# EasyEDA schematic EasyEDA Schematic_Split Flap Remote Board with Index 12-1-23.json
TITLE: Split Flap Remote Board with Index; REV: 1.0; Date: 2023-04-25; Sheet: 1/1; Drawn By: jpwolfe31; Company: John Wolfe
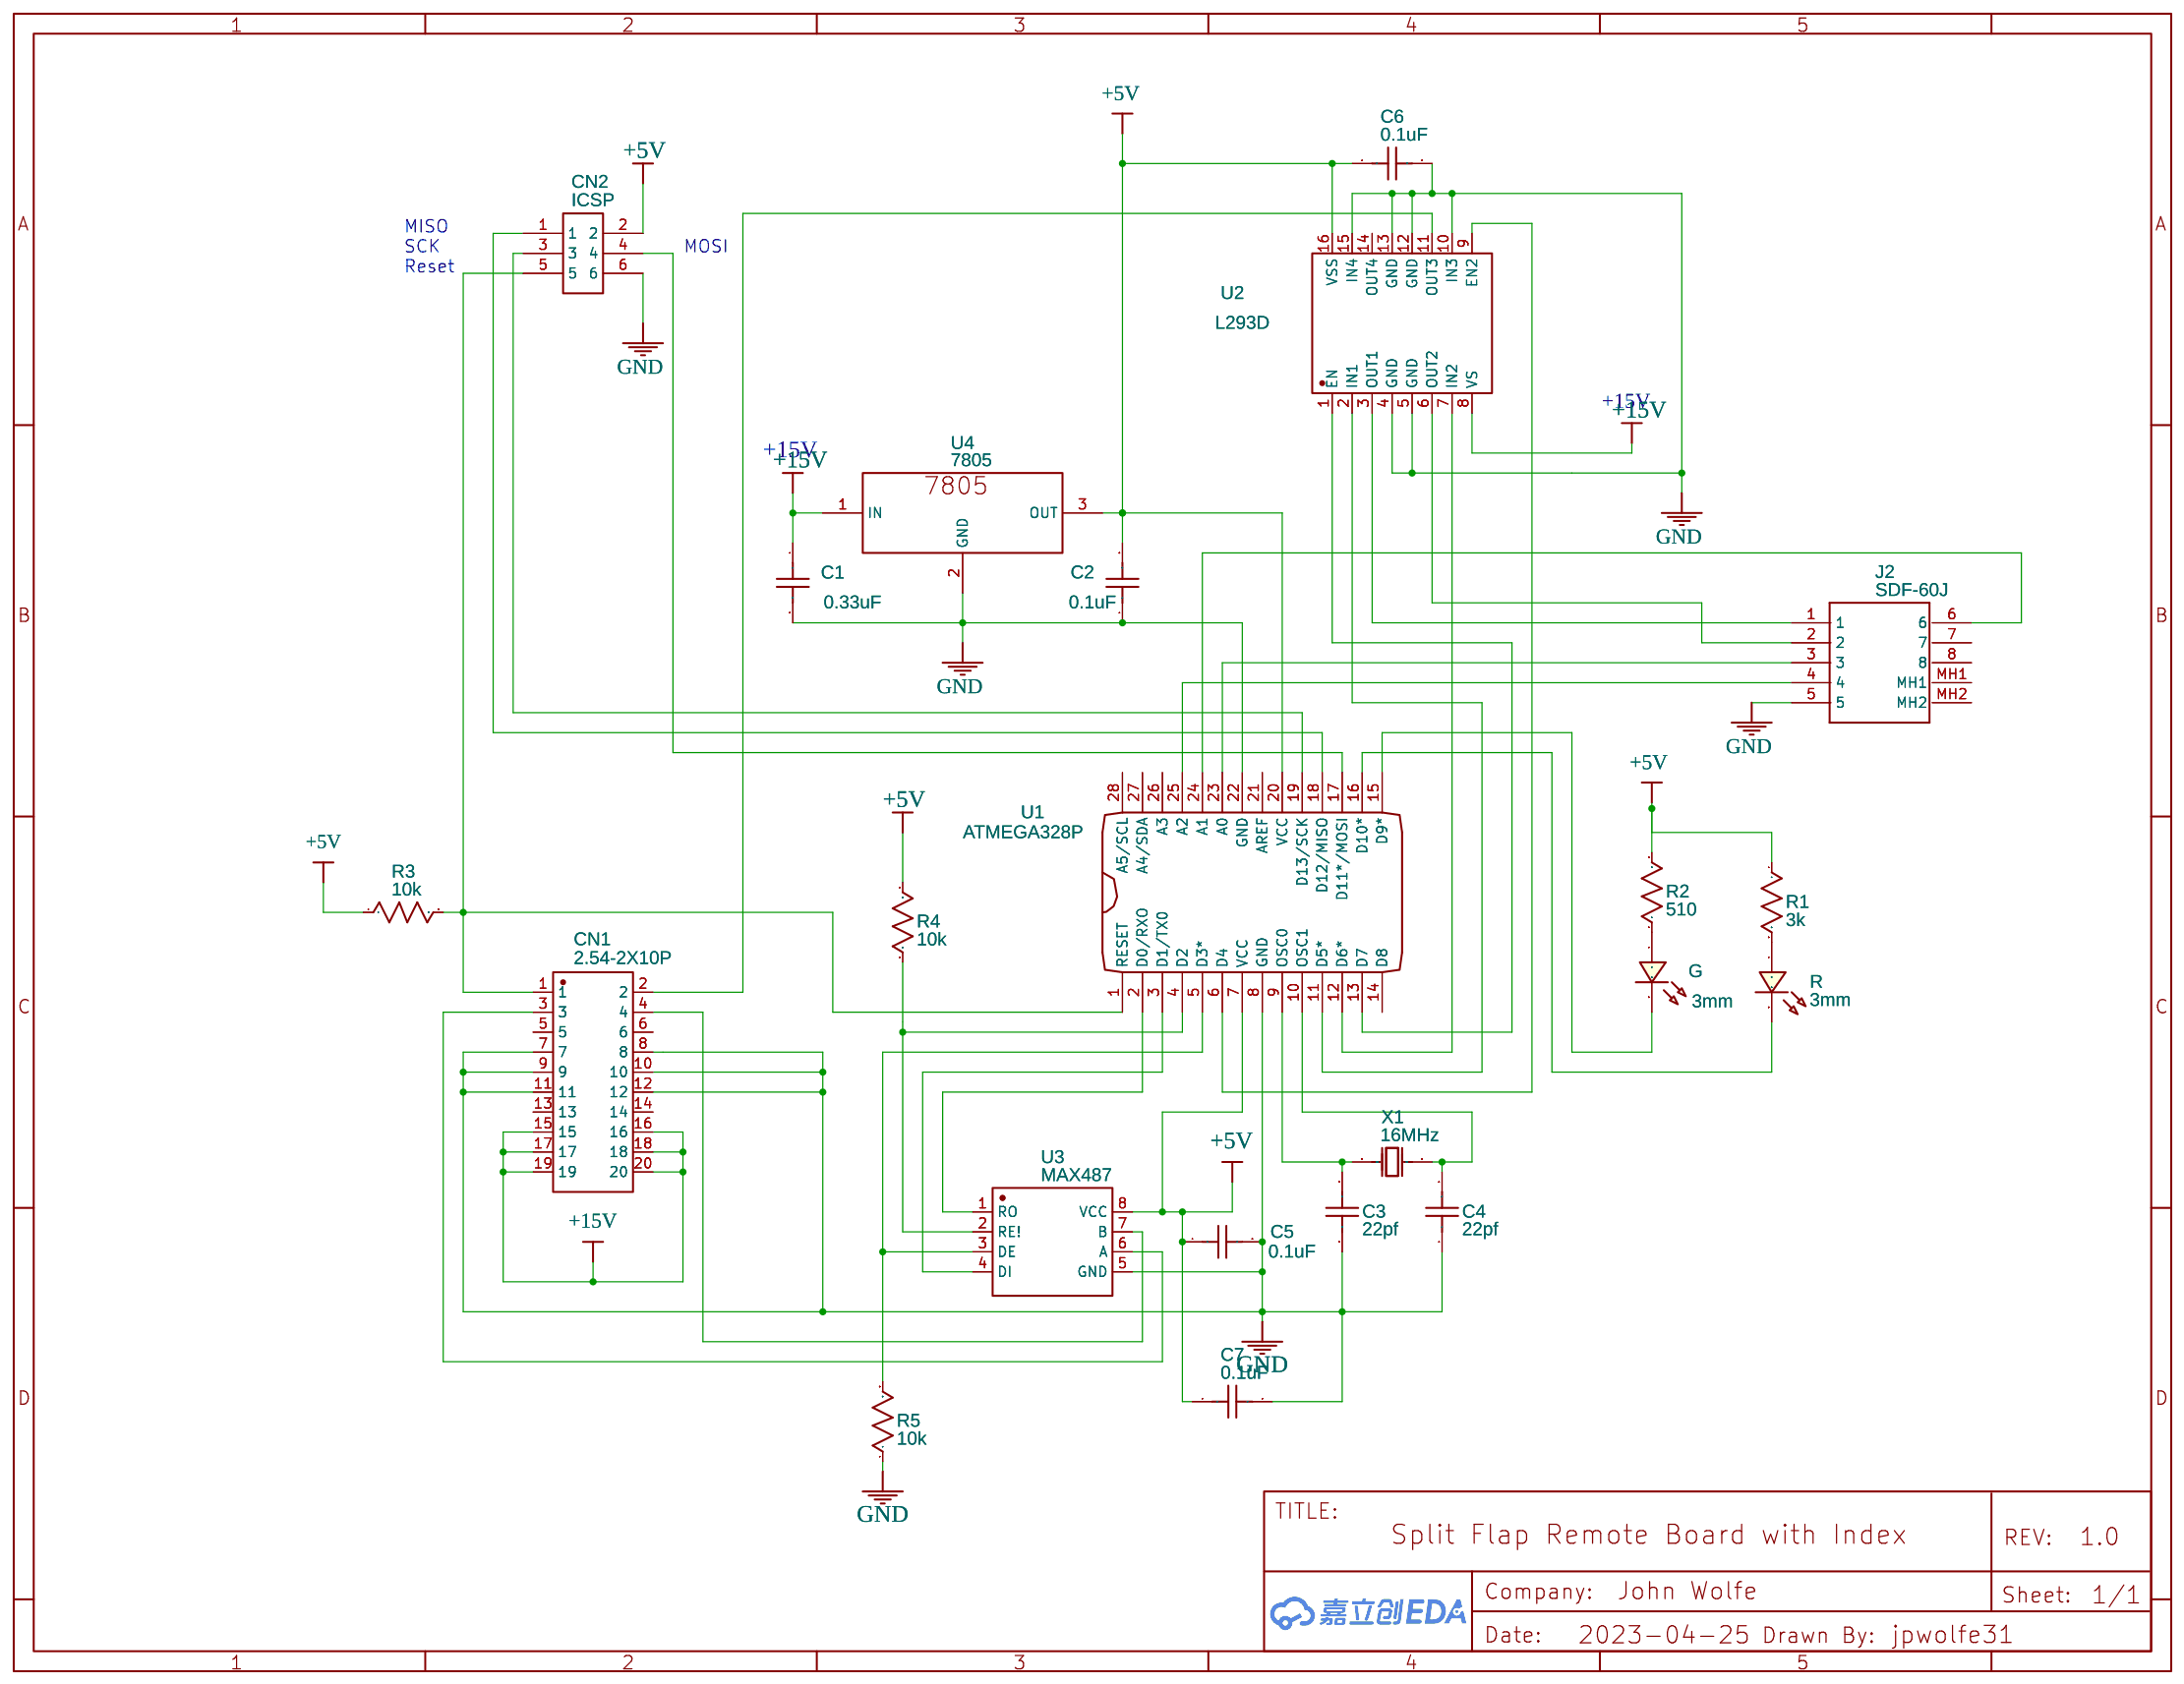
[diagram p0: schematic sheet]

## Parts
C1  0.33uF  [RAD-0.2]
C2  0.1uF  [RAD-0.1]
C3  22pf  [RAD-0.1]
C4  22pf  [RAD-0.1]
C5  0.1uF  [RAD-0.1]
C6  0.1uF  [RAD-0.1]
C7  0.1uF  [RAD-0.1]
CN1  2.54-2X10P  [CONN-TH_20P-P2.54_KINGHELM_KH-DC3-2.54-2X10P]
CN2  ICSP  [ICSP]
G  3mm  [LED-TH_BD3.0_GREEN]
J2  SDF-60J  [SDF60J]
R  3mm  [LED-TH_BD3.0_RED]
R1  3k  [R_AXIAL-0.3]
R2  510  [R_AXIAL-0.3]
R3  10k  [R_AXIAL-0.3]
R4  10k  [R_AXIAL-0.3]
R5  10k  [R_AXIAL-0.3]
U1  ATMEGA328P  [ATMEGA328-PU]
U2  L293D  [DIP-16_L20.4-W5.8-P2.54-LS7.6-BL]
U3  MAX487  [PDIP-8_L9.6-W6.4-P2.54-LS7.9-BL-1]
U4  7805  [7805]
X1  16MHz  [OSC-49S-1]

## Library data of the parts
C1 = C_RAD-0.2_US: Contributor: LCEDA_Lib
C2-C7 = C_RAD-0.1_US: Contributor: LCEDA_Lib
CN1 = KH-DC3-2.54-2X10P: Supplier: LCSC; Supplier Part: C5157633; Manufacturer: kinghelm(金航标); link: https://atta.szlcsc.com/upload/public/pdf/source/20220902/CF025B83B1EC9998494A23D3080F236C.pdf; Contributor: lcsc; JLCPCB Part Class: Extended Part
CN2 = ICSP: Contributor: kgeri01
G = LED-TH-3mm_G: Manufacturer: EVERLIGHT(台湾亿光); Manufacturer Part: 204-10SYGD/S530-E3; Supplier Part: C85161; Contributor: LCEDA_Lib
J2 = SDF-60J: Contributor: nkviswan
R = LED-TH-3mm_R: Manufacturer: EVERLIGHT(台湾亿光); Manufacturer Part: 204-10SDRD/S530-A3-L; Supplier Part: C84774; Supplier: LCSC; Contributor: LCEDA_Lib
R1 R2 R4 R5 = R_AXIAL-0.3_US: Contributor: LCEDA_Lib
R3 = R_AXIAL-0.3_US: Contributor: LCEDA_Lib; Package Display: No
U1 = ATMEGA328 NEW: Contributor: thecodgamer2025; sourceId: 3rfdaKkiS
U2 = L293D_C504385: Supplier: LCSC; Supplier Part: C504385; Manufacturer: Gcore; Contributor: LCSC
U3 = MAX487CPA+: Supplier: LCSC; Supplier Part: C1543795; Manufacturer: ADI(亚德诺)/MAXIM(美信); link: https://atta.szlcsc.com/upload/public/pdf/source/20190920/C431200_20CD57F1384697722A12CE00516D4195.pdf; Contributor: lcsc; JLCPCB Part Class: Extended Part
U4 = 7805: Contributor: 51450
X1 = XTAL16MHZ DIP: Supplier: LCSC; Manufacturer: YXC; Manufacturer Part: X49SD16MSD2SC; Supplier Part: C16212

## Nets
+5V: C2.2 C5.1 C6.1 C7.1 CN2.2 R1.1 R2.2 R3.1 R4.2 U1.7(VCC) U1.20(VCC) U2.16(VSS) U3.8(VCC) U4.3(OUT)
+15V: C1.1 CN1.15 CN1.16 CN1.17 CN1.18 CN1.19 CN1.20 U2.8(VS) U4.1(IN)
GND: C1.2 C2.1 C3.1 C4.1 C5.2 C6.2 C7.2 CN1.7 CN1.8 CN1.9 CN1.10 CN1.11 CN1.12 CN2.6 J2.5 R5.1 U1.8(GND) U1.22(GND) U2.4(GND) U2.5(GND) U2.10(IN3) U2.12(GND) U2.13(GND) U2.15(IN4) U3.5(GND) U4.2(GND)
Net-(C3-2): C3.2 U1.9(OSC0) X1.2(OSC2)
Net-(C4-2): C4.2 U1.10(OSC1) X1.1(OSC1)
Net-(CN1-1): CN1.1 CN2.5 R3.2 U1.1(RESET)
Net-(CN1-2): CN1.2 U2.11(OUT3)
Net-(CN1-3): CN1.3 U3.6(A)
Net-(CN1-4): CN1.4 U3.7(B)
Net-(CN2-1): CN2.1 U1.18(D12/MISO)
Net-(CN2-3): CN2.3 U1.19(D13/SCK)
Net-(CN2-4): CN2.4 U1.17(D11*/MOSI)
Net-(G-1): G.1 R2.1
Net-(G-2): G.2 U1.15(D9*)
Net-(J2-1): J2.1 U2.3(OUT1)
Net-(J2-2): J2.2 U2.6(OUT2)
Net-(J2-3): J2.3 U1.23(A0)
Net-(J2-4): J2.4 U1.25(A2)
Net-(J2-6): J2.6 U1.24(A1)
Net-(R4-1): R4.1 U1.4(D2) U3.2(RE!)
Net-(R5-2): R5.2 U1.5(D3*) U3.3(DE)
Net-(R-1): R.1 R1.2
Net-(R-2): R.2 U1.16(D10*)
Net-(U1-2): U1.2(D0/RXO) U3.1(RO)
Net-(U1-3): U1.3(D1/TX0) U3.4(DI)
Net-(U1-6): U1.6(D4) U2.9(EN2)
Net-(U1-11): U1.11(D5*) U2.2(IN1)
Net-(U1-12): U1.12(D6*) U2.7(IN2)
Net-(U1-13): U1.13(D7) U2.1(EN)

Not connected (* = marked no-connect by the designer): CN1 5 6 13 14; J2 7 8 MH1 MH2; U1 14(D8) 21(AREF) 26(A3) 27(A4/SDA) 28(A5/SCL); U2 14(OUT4)

## Notes on the sheet
- MISO
- Reset
- SCK
- MOSI
- +15V
- +15V
